# EAGLE schematic powerboard (EAGLE 9.0.1)
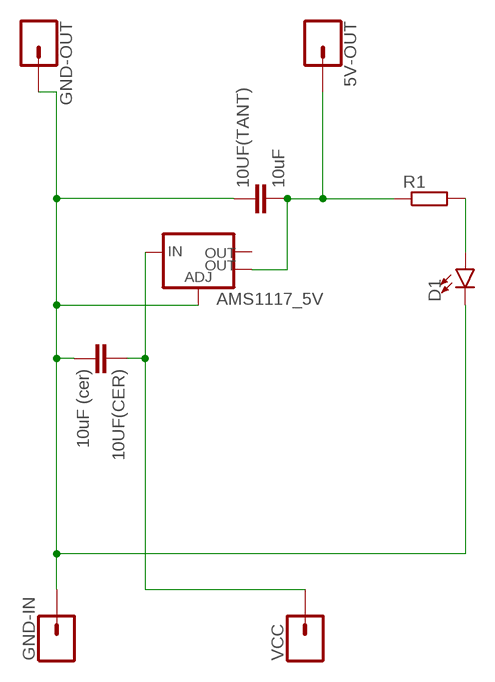
[diagram p0: schematic, sheet 1]

## Parts
5V-OUT  CONN_01PTH_LONGPAD  [1X01_LONGPAD]
10UF(CER)  10uF (cer)  10UF-1206-6.3V-20%  [1206]
10UF(TANT)  10uF  10UF-1206-6.3V-20%  [1206]
AMS1117_5V  V_REG_LM1117SOT223  [SOT223]
D1  LED0603  [LED-0603]
GND-IN  CONN_01PTH_LONGPAD  [1X01_LONGPAD]
GND-OUT  CONN_01PTH_LONGPAD  [1X01_LONGPAD]
R1  R-EU_R0603  [R0603]
VCC  CONN_01PTH_LONGPAD  [1X01_LONGPAD]

## Nets
5V: 5V-OUT.1 10UF(TANT).2 AMS1117_5V.4(OUT) R1.1
GND: 10UF(CER).2 10UF(TANT).1 AMS1117_5V.1(ADJ) D1.C GND-IN.1 GND-OUT.1
N$1: D1.A R1.2
VCC: 10UF(CER).1 AMS1117_5V.3(IN) VCC.1
Unconnected: AMS1117_5V.2(OUT)

## Library data of the parts
5V-OUT GND-IN GND-OUT VCC = SparkFun-Connectors:CONN_01: Single connection point. Often used as Generic Header-pin footprint for 0.1 inch spaced/style header connections On any of the 0.1 inch spaced packages, you can populate with these: Break Away Headers - Straight <https://www.sparkfun.com/products/116> (PRT-00116) Break Away Male Headers - Right Angle <https://www.sparkfun.com/products/553> (PRT-00553) Female Headers <https://www.sparkfun.com/products/115> (PRT-00115) Break Away Headers - Machine Pin <https://www.sparkfun.com/products/117> (PRT-00117) Break Away Female Headers - Swiss Machine Pin <https://www.sparkfun.com/products/743> (PRT-00743) This device is also useful as a general connection point to wire up your design to another part of your project. Our various solder wires solder well into these plated through hole pads. Hook-Up Wire - Assortment (Stranded, 22 AWG) <https://www.sparkfun.com/products/11375> (PRT-11375) Hook-Up Wire - Assortment (Solid Core, 22 AWG) <https://www.sparkfun.com/products/11367> (PRT-11367) View the entire wire category on our website here <https://www.sparkfun.com/categories/141> Special notes: SMTSO-256-ET is a "flush mount" nut for a 4-40 screw. We mostly use this on specialty testbeds; it is a nice way to connect hardware to your PCB at an adjustable hieght. Also note, the SNAP packages are for using a snappable style connector. We sell a baggie of snaps and they are also used on two LilyPad designs: Snap Assortment - 30 pack (male and female) <https://www.sparkfun.com/products/11347> (DEV-11347) LilyPad Arduino SimpleSnap <https://www.sparkfun.com/products/10941> (DEV-10941) LilyPad SimpleSnap Protoboard <https://www.sparkfun.com/products/10940> (DEV-10940)
10UF(CER) = SparkFun-Capacitors:10UF: 10.0µF ceramic capacitors A capacitor is a passive two-terminal electrical component used to store electrical energy temporarily in an electric field.; PROD_ID: CAP-10057; VALUE: 10uF
10UF(TANT) = SparkFun-Capacitors:10UF: 10.0µF ceramic capacitors A capacitor is a passive two-terminal electrical component used to store electrical energy temporarily in an electric field.; PROD_ID: CAP-10057
AMS1117_5V = SparkFun-IC-Power:V_REG_LM1117: Voltage Regulator LM1117 Standard adjustable voltage regulator but in SMD form. Spark Fun Electronics SKU : COM-00595; PROD_ID: VREG-08170
D1 = SparkFun-LED:LED: LED (Generic) Standard schematic elements and footprints for 5mm, 3mm, 1206, and 0603 sized LEDs. Generic LEDs with no color specified.
R1 = Clean-Kong:R-EU_: RESISTOR, European symbol

## Net classes
0 default: width 0.4 mm, drill 0.3 mm, clearance 0.4 mm